# EAGLE design 9DOF-board (EAGLE 6.6.0)
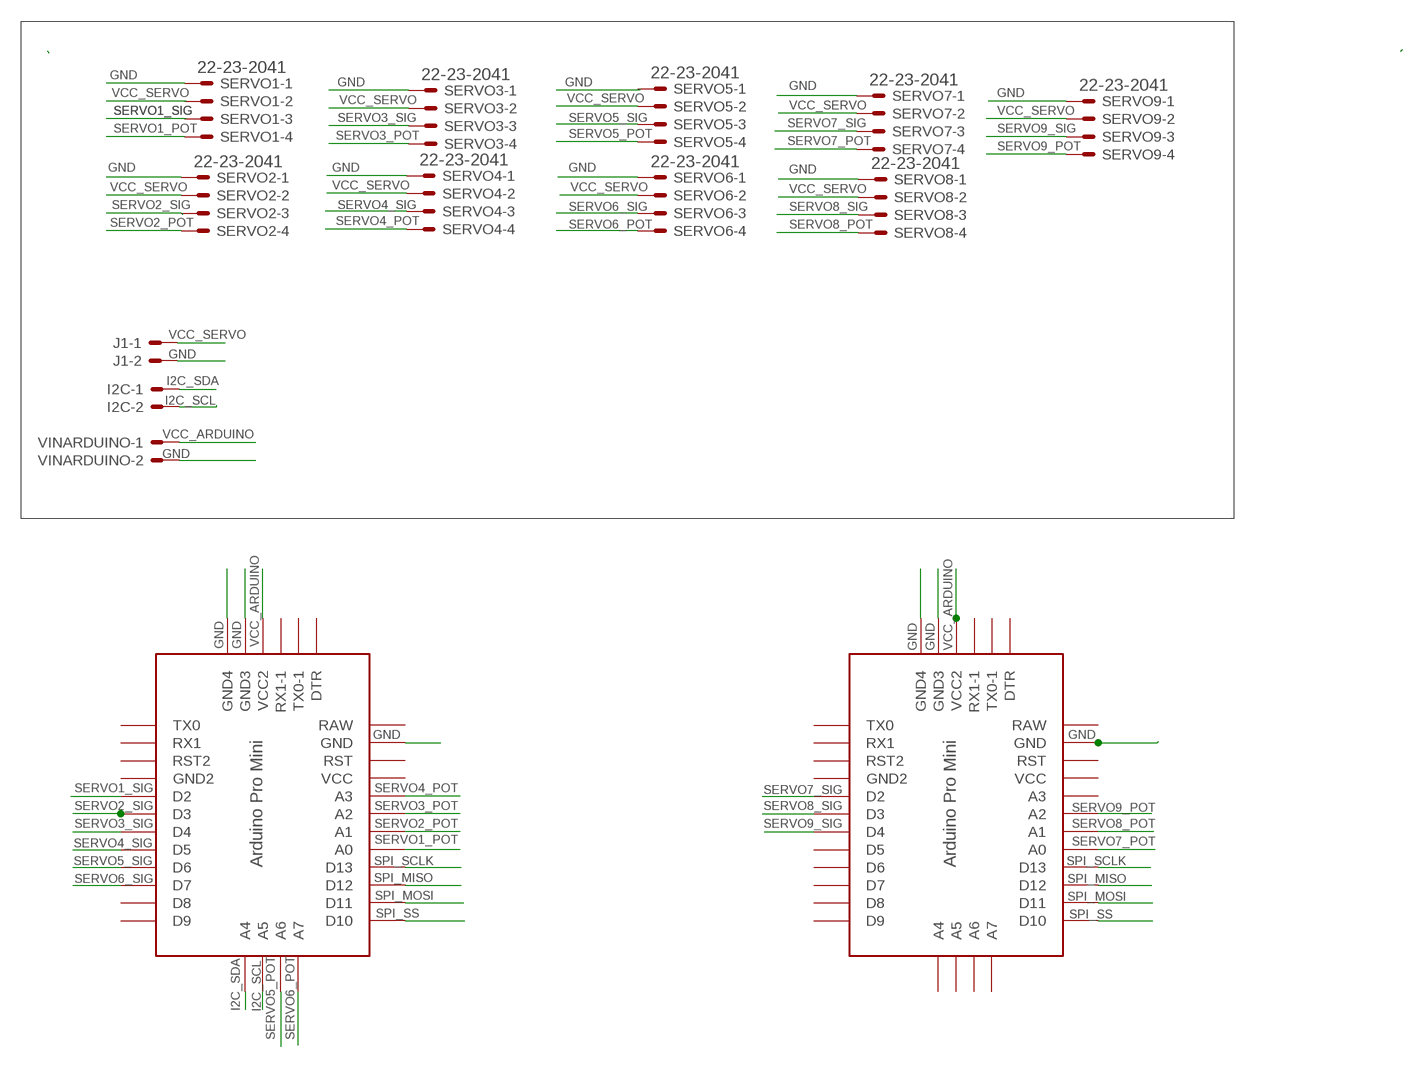
[diagram p0: schematic, sheet 1]

## Parts
I2C  22-23-2021  [22-23-2021]
J1  22-23-2021  [22-23-2021]
SERVO1  22-23-2041  [22-23-2041]
SERVO2  22-23-2041  [22-23-2041]
SERVO3  22-23-2041  [22-23-2041]
SERVO4  22-23-2041  [22-23-2041]
SERVO5  22-23-2041  [22-23-2041]
SERVO6  22-23-2041  [22-23-2041]
SERVO7  22-23-2041  [22-23-2041]
SERVO8  22-23-2041  [22-23-2041]
SERVO9  22-23-2041  [22-23-2041]
U$1  PRO-MINI  [PRO-MINI]
U$2  PRO-MINI  [PRO-MINI]
VINARDUINO  22-23-2021  [22-23-2021]

## Nets
GND: J1.2 SERVO1.1 SERVO2.1 SERVO3.1 SERVO4.1 SERVO6.1 SERVO7.1 SERVO8.1 SERVO9.1 U$1.GND U$1.GND2(GND4) U$1.GND3 U$2.GND U$2.GND2(GND4) U$2.GND3 VINARDUINO.2
I2C_SCL: I2C.2 U$1.A5
I2C_SDA: I2C.1 U$1.A4
SERVO1_POT: SERVO1.4 U$1.A0
SERVO1_SIG: SERVO1.3 U$1.D2
SERVO2_POT: SERVO2.4 U$1.A1
SERVO2_SIG: SERVO2.3 U$1.D3
SERVO3_POT: SERVO3.4 U$1.A2
SERVO3_SIG: SERVO3.3 U$1.D4
SERVO4_POT: SERVO4.4 U$1.A3
SERVO4_SIG: SERVO4.3 U$1.D5
SERVO5_POT: SERVO5.4 U$1.A6
SERVO5_SIG: SERVO5.3 U$1.D6
SERVO6_POT: SERVO6.4 U$1.A7
SERVO6_SIG: SERVO6.3 U$1.D7
SERVO7_POT: SERVO7.4 U$2.A0
SERVO7_SIG: SERVO7.3 U$2.D2
SERVO8_POT: SERVO8.4 U$2.A1
SERVO8_SIG: SERVO8.3 U$2.D3
SERVO9_POT: SERVO9.4 U$2.A2
SERVO9_SIG: SERVO9.3 U$2.D4
SPI_MISO: U$1.D12 U$2.D12
SPI_MOSI: U$1.D11 U$2.D11
SPI_SCLK: U$1.D13 U$2.D13
SPI_SS: U$1.D10 U$2.D10
VCC_ARDUINO: U$1.VCC1(VCC2) U$2.VCC1(VCC2) VINARDUINO.1
VCC_SERVO: J1.1 SERVO1.2 SERVO2.2 SERVO3.2 SERVO4.2 SERVO5.2 SERVO6.2 SERVO7.2 SERVO8.2 SERVO9.2
Unconnected: SERVO5.1 U$1.D8 U$1.D9 U$1.DTR U$1.GND1(GND2) U$1.RST U$1.RST1(RST2) U$1.RX1 U$1.RX1-1 U$1.TX0 U$1.TX0-1 U$1.VCC U$2.A3 U$2.A4 U$2.A5 U$2.A6 U$2.A7 U$2.D5 U$2.D6 U$2.D7 U$2.D8 U$2.D9 U$2.DTR U$2.GND1(GND2) U$2.RST U$2.RST1(RST2) U$2.RX1 U$2.RX1-1 U$2.TX0 U$2.TX0-1 U$2.VCC

## Power pins joined to a net without a drawn wire
RAW: U$1.RAW U$2.RAW

## Library data of the parts
I2C J1 VINARDUINO = con-molex:22-23-2021: .100" (2.54mm) Center Header - 2 Pin; MF: MOLEX; MPN: 22-23-2021; OC_FARNELL: 1462926; OC_NEWARK: 25C3832
SERVO1-SERVO9 = con-molex:22-23-2041: .100" (2.54mm) Center Header - 4 Pin; MF: MOLEX; MPN: 22-23-2041; OC_FARNELL: 1462920; OC_NEWARK: 38C0355
U$1 U$2 = Arduino-clone:PRO-MINI: Arduion Pro Mini Clone V1.0 www.betemcu.cu

## Net classes
0 Default: width 0.152 mm, drill 0.203 mm, clearance 0.152 mm

## Board
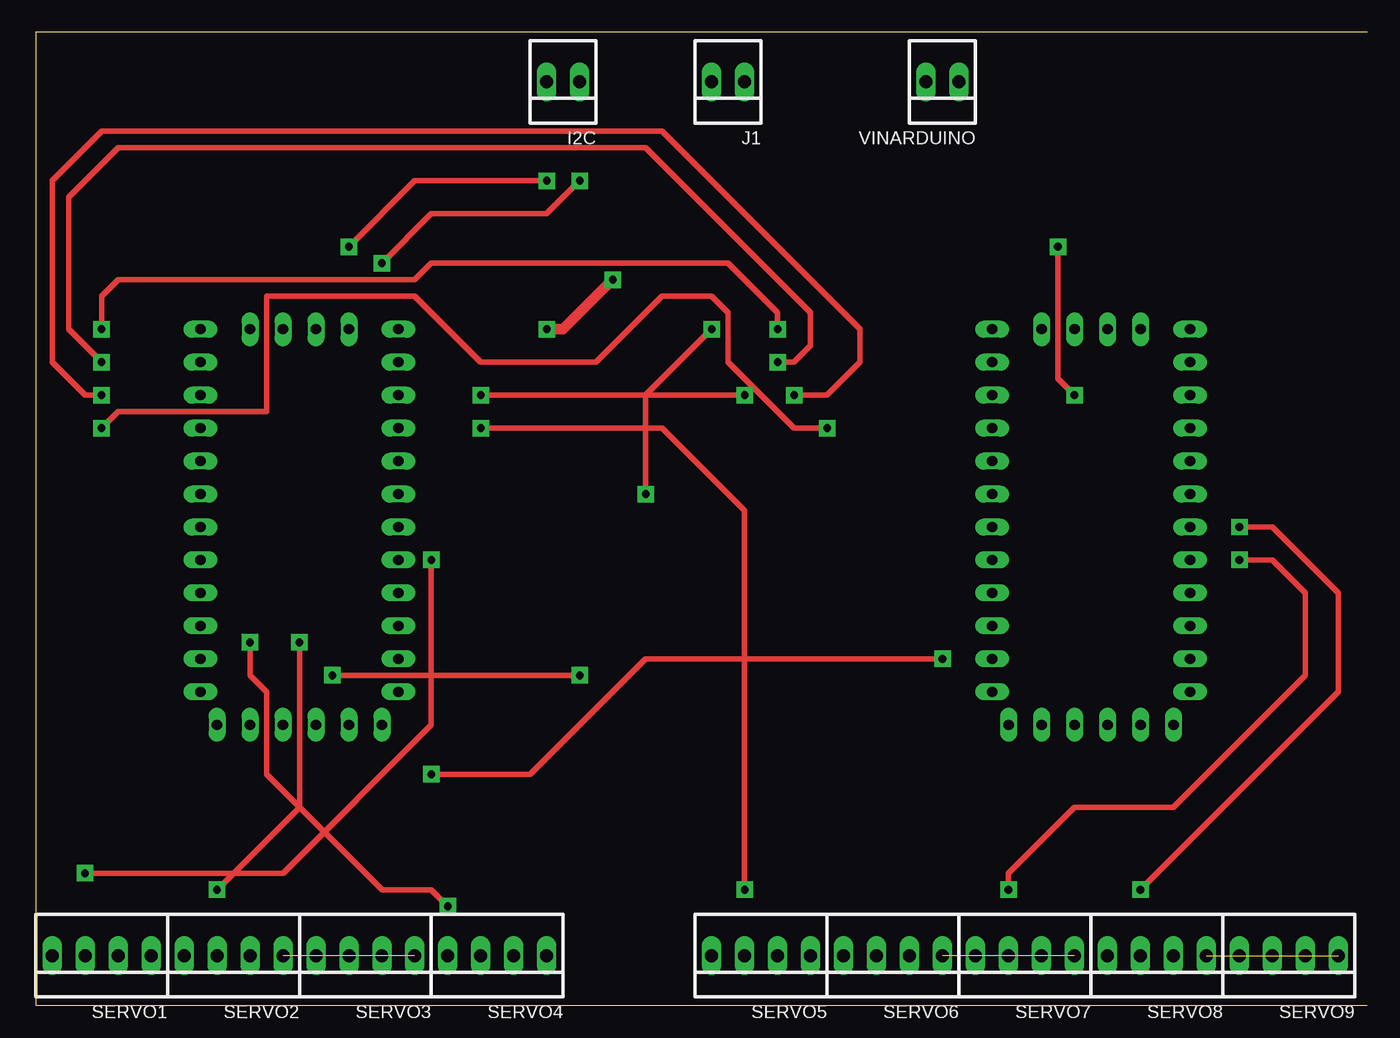
[diagram p1: board, top side]
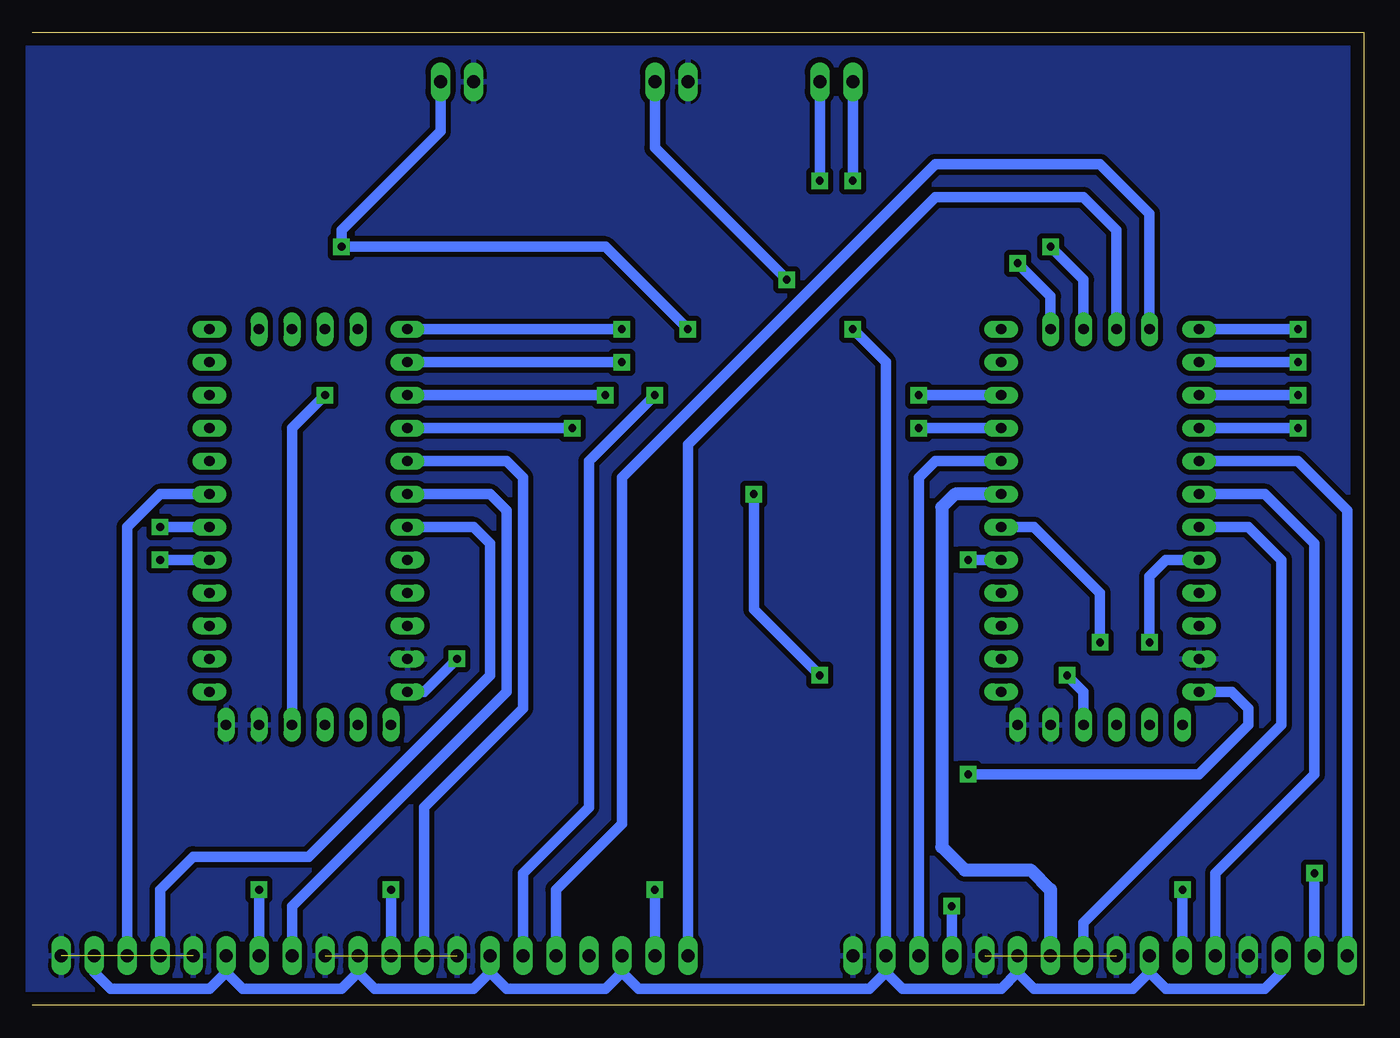
[diagram p2: board, bottom side, seen from below]

Size 102.54 x 74.92 mm. Coordinates in mm from the lower left corner, seen from the top.
Outline: 102.54,0 0,0 0,74.92 102.54,74.92
Copper layers (1*16): Top 0.035mm / dielectric 1.5mm / Bottom 0.035mm
Design rules "fresa *": minimum track width 10mil, minimum drill 24mil, track to track 0.4mm, track to pad 0.4mm, pad to pad 0.4mm, via to via 0.4mm, smd to smd 6mil, copper to edge 40mil, drill to drill 8mil, minimum pad ring 10mil, minimum via ring 8mil, stop-mask expansion 4mil, vias tented up to drill 0mil, thermal gap 10mil

### Footprints (pad centres in the part's own frame; a part is rotated, then mirrored left to right if it is on the bottom)
22-23-2021 = drill 1 long: 1 -1.27,0; 2 1.27,0
22-23-2041 = drill 1 long: 1 -3.81,0; 2 -1.27,0; 3 1.27,0; 4 3.81,0
PRO-MINI = drill 0.8 long: A0 8.89,8.89; A1 8.89,11.43; A2 8.89,13.97; A3 8.89,16.51; A4 -2.54,-1.27; A5 0,-1.27; A6 2.54,-1.27; A7 5.08,-1.27; D2 -6.35,16.51; D3 -6.35,13.97; D4 -6.35,11.43; D5 -6.35,8.89; D6 -6.35,6.35; D7 -6.35,3.81; D8 -6.35,1.27; D9 -6.35,-1.27; D10 8.89,-1.27; D11 8.89,1.27; D12 8.89,3.81; D13 8.89,6.35; DTR 7.62,29.21; GND 8.89,24.13; GND1 -6.35,19.05; GND2 -5.08,29.21; GND3 -2.54,29.21; RAW 8.89,26.67; RST 8.89,21.59; RST1 -6.35,21.59; RX1 -6.35,24.13; RX1-1 2.54,29.21; TX0 -6.35,26.67; TX0-1 5.08,29.21; VCC 8.89,19.05; VCC1 0,29.21

### Placement (x,y rotation side)
I2C  40.64,71.12 180 top
J1  53.34,71.12 180 top
SERVO1  5.08,3.81 180 top
SERVO2  15.24,3.81 180 top
SERVO3  25.4,3.81 180 top
SERVO4  35.56,3.81 180 top
SERVO5  55.88,3.81 180 top
SERVO6  66.04,3.81 180 top
SERVO7  76.2,3.81 180 top
SERVO8  86.36,3.81 180 top
SERVO9  96.52,3.81 180 top
U$1  21.59,50.8 180 top
U$2  82.55,50.8 180 top
VINARDUINO  69.85,71.12 180 top

### Tracks (layer width: path | path; a pad name or v marks a point on that pad's centre or on a via)
GND  (3 unrouted)
  pour Bottom: -12.7,-5.08 -12.7,74.93 102.87,74.93 102.87,-5.08
I2C_SCL  (via drill 0.6 pad 1.27)
  Top 0.406: v24.13,58.42 29.21,63.5 v39.37,63.5
  Bottom 0.813: U$1.A5 21.59,55.88 v24.13,58.42 | I2C.2 v39.37,63.5
I2C_SDA  (via drill 0.6 pad 1.27)
  Top 0.406: v26.67,57.15 30.48,60.96 39.37,60.96 v41.91,63.5
  Bottom 0.813: U$1.A4 24.13,54.61 v26.67,57.15 | I2C.1 v41.91,63.5
RAW  (via drill 0.6 pad 1.27)
  Top 0.406: v69.85,26.67 46.99,26.67 38.1,17.78 v30.48,17.78
  Bottom 0.813: U$2.RAW 72.39,24.13 v69.85,26.67 | U$1.RAW 10.16,24.13 8.89,22.86 8.89,21.59 12.7,17.78 v30.48,17.78
SERVO1_POT
  Bottom 0.813: SERVO1.4 1.27,38.1 5.08,41.91 U$1.A0
SERVO1_SIG  (via drill 0.6 pad 1.27)
  Top 0.406: v3.81,10.16 19.05,10.16 30.48,21.59 v30.48,34.29
  Bottom 0.813: v30.48,34.29 U$1.D2 | SERVO1.3 v3.81,10.16
SERVO2_POT
  Bottom 0.813: SERVO2.4 11.43,10.16 3.81,17.78 3.81,35.56 7.62,39.37 U$1.A1
SERVO2_SIG  (via drill 0.6 pad 1.27)
  Top 0.406: v20.32,27.94 20.32,15.24 v13.97,8.89
  Bottom 0.813: U$1.D3 25.4,36.83 20.32,31.75 v20.32,27.94 | v13.97,8.89 SERVO2.3
SERVO3_POT
  Bottom 0.813: SERVO3.4 21.59,6.35 6.35,21.59 6.35,34.29 8.89,36.83 U$1.A2
SERVO3_SIG
  Bottom 1.016: U$1.D4 31.5,39.37 32.51,38.35 32.51,12.19 30.73,10.41 25.65,10.41 24.13,8.89 SERVO3.3
SERVO4_POT  (via drill 0.6 pad 1.27)
  Top 0.406: v16.51,27.94 16.51,25.4 17.78,24.13 17.78,17.78 26.67,8.89 30.48,8.89 v31.75,7.62
  Bottom 0.813: v16.51,27.94 16.51,33.02 15.24,34.29 U$1.A3 | SERVO4.4 v31.75,7.62
SERVO4_SIG
  Bottom 0.813: U$1.D5 33.02,41.91 34.29,40.64 SERVO4.3
SERVO5_POT
  Bottom 0.813: U$1.A6 19.05,59.69 21.59,62.23 33.02,62.23 52.07,43.18 SERVO5.4
SERVO5_SIG  (via drill 0.6 pad 1.27)
  Top 0.406: v54.61,8.89 54.61,38.1 48.26,44.45 v34.29,44.45
  Bottom 0.813: SERVO5.3 v54.61,8.89 | v34.29,44.45 U$1.D6
SERVO6_POT
  Bottom 0.813: U$1.A7 16.51,60.96 20.32,64.77 33.02,64.77 57.15,40.64 57.15,13.97 62.23,8.89 SERVO6.4
SERVO6_SIG  (via drill 0.6 pad 1.27)
  Top 0.406: v54.61,46.99 v34.29,46.99
  Bottom 0.813: SERVO6.3 64.77,10.16 59.69,15.24 59.69,41.91 v54.61,46.99 | v34.29,46.99 U$1.D7
SERVO7_POT
  Bottom 0.813: SERVO7.4 72.39,15.24 64.77,22.86 64.77,38.1 64.77,40.64 66.04,41.91 U$2.A0
SERVO7_SIG  (via drill 0.6 pad 1.27)
  Top 0.406: v74.93,8.89 74.93,10.16 80.01,15.24 87.63,15.24 97.79,25.4 97.79,31.75 95.25,34.29 v92.71,34.29
  Bottom 0.813: SERVO7.3 v74.93,8.89 | U$2.D2 v92.71,34.29
SERVO8_POT
  Bottom 0.813: SERVO8.4 82.55,7.62 66.04,24.13 66.04,38.1 67.31,39.37 U$2.A1
SERVO8_SIG  (via drill 0.6 pad 1.27)
  Top 0.406: v85.09,8.89 100.33,24.13 100.33,31.75 95.25,36.83 v92.71,36.83
  Bottom 0.813: SERVO8.3 v85.09,8.89 | U$2.D3 v92.71,36.83
SERVO9_POT
  Bottom 0.813: SERVO9.4 92.71,8.89 90.17,11.43 81.28,11.43 67.31,25.4 67.31,35.56 68.58,36.83 U$2.A2
SERVO9_SIG
  Bottom 0.813: SERVO9.3 95.25,36.83 92.71,39.37 U$2.D4
SPI_MISO  (via drill 0.6 pad 1.27)
  Top 0.406: v58.42,46.99 60.96,46.99 63.5,49.53 63.5,52.07 48.26,67.31 5.08,67.31 1.27,63.5 1.27,49.53 3.81,46.99 v5.08,46.99
  Bottom 0.813: U$1.D12 v5.08,46.99 | U$2.D12 v58.42,46.99
SPI_MOSI  (via drill 0.6 pad 1.27)
  Top 0.406: v57.15,49.53 58.42,49.53 59.69,50.8 59.69,53.34 46.99,66.04 6.35,66.04 2.54,62.23 2.54,52.07 v5.08,49.53
  Bottom 0.813: U$1.D11 v5.08,49.53 | U$2.D11 v57.15,49.53
SPI_SCLK  (via drill 0.6 pad 1.27)
  Top 0.406: v60.96,44.45 58.42,44.45 53.34,49.53 53.34,53.34 52.07,54.61 48.26,54.61 43.18,49.53 34.29,49.53 29.21,54.61 17.78,54.61 17.78,45.72 6.35,45.72 v5.08,44.45
  Bottom 0.813: U$1.D13 v5.08,44.45 | U$2.D13 v60.96,44.45
SPI_SS  (via drill 0.6 pad 1.27)
  Top 0.406: v5.08,52.07 5.08,54.61 6.35,55.88 29.21,55.88 30.48,57.15 53.34,57.15 57.15,53.34 v57.15,52.07
  Bottom 0.813: U$1.D10 v5.08,52.07 | U$2.D10 v57.15,52.07
VCC_ARDUINO  (via drill 0.6, 0.6 pad 1.27)
  Top 0.406: v80.01,46.99 78.74,48.26 v78.74,58.42 | v22.86,25.4 v41.91,25.4 | v46.99,39.37 46.99,46.99 v52.07,52.07
  Bottom 0.813: v80.01,46.99 82.55,44.45 U$2.VCC1 | VINARDUINO.1 71.12,67.31 78.74,59.69 v78.74,58.42 58.42,58.42 v52.07,52.07 | v22.86,25.4 21.59,24.13 U$1.VCC1 | v41.91,25.4 46.99,30.48 v46.99,39.37
VCC_SERVO  (via drill 0.6 pad 1.27)
  Top 0.813: v39.37,52.07 40.64,52.07 v44.45,55.88
  Bottom 0.406: SERVO4.2 36.83,2.54
  Bottom 0.813: v39.37,52.07 36.83,49.53 SERVO4.2 | J1.1 54.61,66.04 v44.45,55.88 | SERVO1.2 6.35,2.54 7.62,1.27 15.24,1.27 16.51,2.54 | SERVO2.2 16.51,2.54 | 16.51,2.54 17.78,1.27 25.4,1.27 26.67,2.54 | SERVO3.2 26.67,2.54 | 26.67,2.54 27.94,1.27 35.56,1.27 36.83,2.54 38.1,1.27 55.88,1.27 57.15,2.54 | SERVO5.2 57.15,2.54 | 57.15,2.54 58.42,1.27 66.04,1.27 67.31,2.54 | SERVO6.2 67.31,2.54 | 67.31,2.54 68.58,1.27 76.2,1.27 77.47,2.54 | SERVO7.2 77.47,2.54 | 77.47,2.54 78.74,1.27 86.36,1.27 87.63,2.54 | SERVO8.2 87.63,2.54 | 87.63,2.54 88.9,1.27 96.52,1.27 97.79,2.54 SERVO9.2